# Altium schematic sheet 4-IO.SchDoc
size C
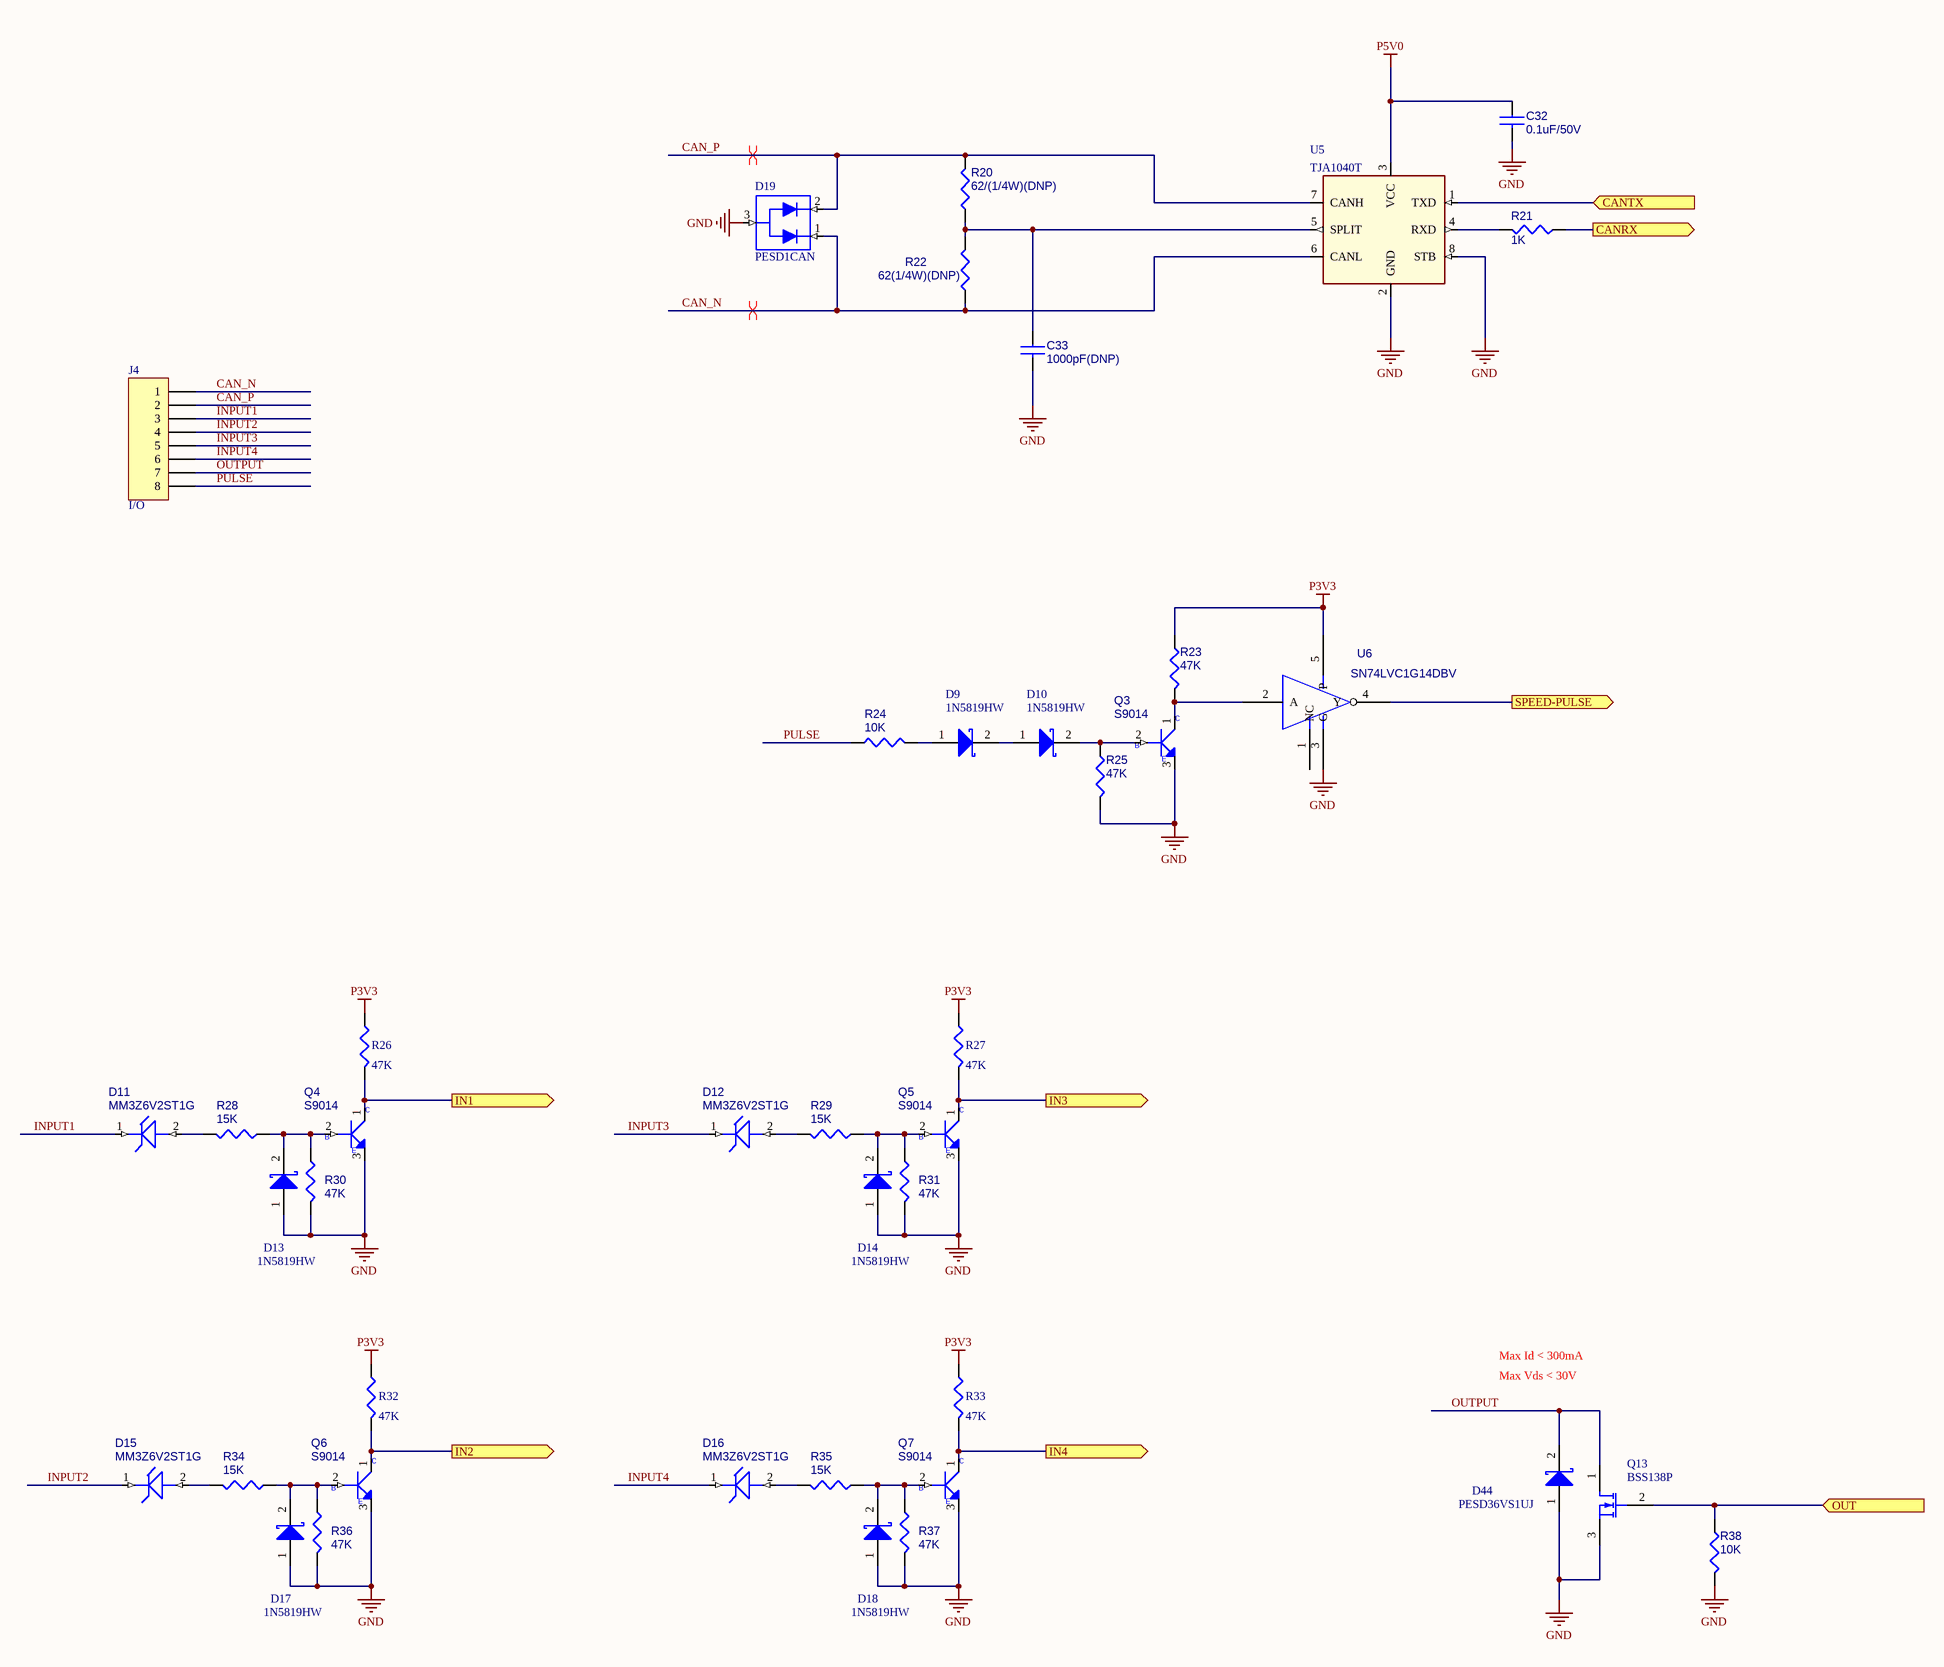
[diagram p0: 4-IO.SchDoc]

## Parts
C32  0.1uF/50V  [0402]
C33  1000pF(DNP)  [0402]
D9  1N5819HW  [1N5819]
D10  1N5819HW  [1N5819]
D11  MM3Z6V2ST1G  [SOD323F]
D12  MM3Z6V2ST1G  [SOD323F]
D13  1N5819HW  [1N5819]
D14  1N5819HW  [1N5819]
D15  MM3Z6V2ST1G  [SOD323F]
D16  MM3Z6V2ST1G  [SOD323F]
D17  1N5819HW  [1N5819]
D18  1N5819HW  [1N5819]
D19  PESD1CAN  [PESD2CAN]
D44  PESD36VS1UJ  [SOD323]
J4  I/O  [XH2.54-SMT-V-8P]
Q3  S9014  [NPN]
Q4  S9014  [NPN]
Q5  S9014  [NPN]
Q6  S9014  [NPN]
Q7  S9014  [NPN]
Q13  BSS138P  [NPN]
R20  62/(1/4W)(DNP)  [1206]
R21  1K  [0402]
R22  62(1/4W)(DNP)  [1206]
R23  47K  [0402]
R24  10K  [0402]
R25  47K  [0402]
R26  47K  [0402]
R27  47K  [0402]
R28  15K  [0603]
R29  15K  [0603]
R30  47K  [0402]
R31  47K  [0402]
R32  47K  [0402]
R33  47K  [0402]
R34  15K  [0603]
R35  15K  [0603]
R36  47K  [0402]
R37  47K  [0402]
R38  10K  [0402]
U5  TJA1040T  [SO8]
U6  SN74LVC1G14DBV  [SOT23-5]

## Ports
CANRX (out), CANTX (in), IN1 (out), IN2 (out), IN3 (out), IN4 (out), OUT (in), SPEED-PULSE (out)

## Nets
GND: C32.2 C33.2 D13.1(A) D14.1(A) D17.1(A) D18.1(A) D19.3 D44.1(A) Q3.3(EMITTER) Q4.3(EMITTER) Q5.3(EMITTER) Q6.3(EMITTER) Q7.3(EMITTER) Q13.3(S) R25.1 R30.2 R31.2 R36.2 R37.2 R38.2 U5.2(GND) U5.8(STB) U6.3(G)
P3V3: R23.2 R26.1 R27.1 R32.1 R33.1 U6.5(P)
P5V0: C32.1 U5.3(VCC)
CAN_N: D19.1 J4.1 R22.2 U5.6(CANL)
CAN_P: D19.2 J4.2 R20.1 U5.7(CANH)
CANRX: R21.2 ; port CANRX
CANTX: U5.1(TXD) ; port CANTX
IN1: Q4.1(COLLECTOR) R26.2 ; port IN1
IN2: Q6.1(COLLECTOR) R32.2 ; port IN2
IN3: Q5.1(COLLECTOR) R27.2 ; port IN3
IN4: Q7.1(COLLECTOR) R33.2 ; port IN4
INPUT1: D11.1 J4.3
INPUT2: D15.1 J4.4
INPUT3: D12.1 J4.5
INPUT4: D16.1 J4.6
OUT: Q13.2(G) R38.1 ; port OUT
OUTPUT: D44.2(K) J4.7 Q13.1(D)
PULSE: J4.8 R24.2
SPEED-PULSE: U6.4(Y) ; port SPEED-PULSE
NetC33_1: C33.1 R20.2 R22.1 U5.5(SPLIT)
NetD9_1: D9.1(A) R24.1
NetD9_2: D9.2(K) D10.1(A)
NetD10_2: D10.2(K) Q3.2(BASE) R25.2
NetD11_2: D11.2 R28.2
NetD12_2: D12.2 R29.2
NetD13_2: D13.2(K) Q4.2(BASE) R28.1 R30.1
NetD14_2: D14.2(K) Q5.2(BASE) R29.1 R31.1
NetD15_2: D15.2 R34.2
NetD16_2: D16.2 R35.2
NetD17_2: D17.2(K) Q6.2(BASE) R34.1 R36.1
NetD18_2: D18.2(K) Q7.2(BASE) R35.1 R37.1
NetQ3_1: Q3.1(COLLECTOR) R23.1 U6.2(A)
NetR21_1: R21.1 U5.4(RXD)

Not connected (* = marked no-connect by the designer): U6 1(NC)

## Layout directives
differential pair: CAN_N, CAN_P

## Notes on the sheet
- Max Id < 300mA
- Max Vds < 30V
- (in symbol MMBT3904_NL_SOT23-3) C; B; E

## Library data of the parts
C32 C33 = P_CAP NP
D9 D10 D13 D14 D17 D18 D44 = Diode 11DQ03: Schottky Rectifier
D11 D12 D15 D16 = MMGZ5231BPTLL34
D19 = PESD2CAN: Part Number: SCA00000J00
J4 = Header 8: Header, 8-Pin; LatestRevisionDate: 17-Jul-2002; LatestRevisionNote: Re-released for DXP Platform.; Publisher: Altium Limited
Q3-Q7 = MMBT3904_NL_SOT23-3: Part Description: S TR MMBT3904_NL NPN SOT23; Part Number: SB039040000
Q13 = MOSFET-N: N-Channel MOSFET; Published: 8-Jun-2000; LatestRevisionDate: 17-Jul-2002; LatestRevisionNote: Re-released for DXP Platform.; PackageVersion: 1995/1996; PackageReference: E3; Publisher: Altium Limited; PackageDescription: TO, Flat Index; 3 In-Line, Axial Leads; Body Dia. 4.6mm; Lead Dia. 0.5 mm (max)
R20-R25 = P_R
R26 R27 R32 R33 = Res3: Resistor; Value: 1K; Published: 8-Jun-2000; LatestRevisionDate: 29-May-2009; LatestRevisionNote: IPC-7351 Footprint Added.; PackageReference: J1-0603; Publisher: Altium Limited; PackageDescription: Chip Resistor
R28-R31 R34-R38 = R
U5 = TJA1040T_SO_8P: IC XCVR CAN HS 5V SO8; CAD_APPROVED: Yes; MFG_NAME01: NXP SEMICONDUCTORS; AGILE_PN: 312-79676; CLASS: IC; HEIGHT: 1.75 MM; ROHS: Yes; MFG_PN01: TJA1040T
U6 = 74LVC1G04GW_SOT353-5: Part  Number: SA00000FX00